# EAGLE design PCB_Minisumo_2018_Educatiu (EAGLE 9.2.1)

## Sheet 1 of 2
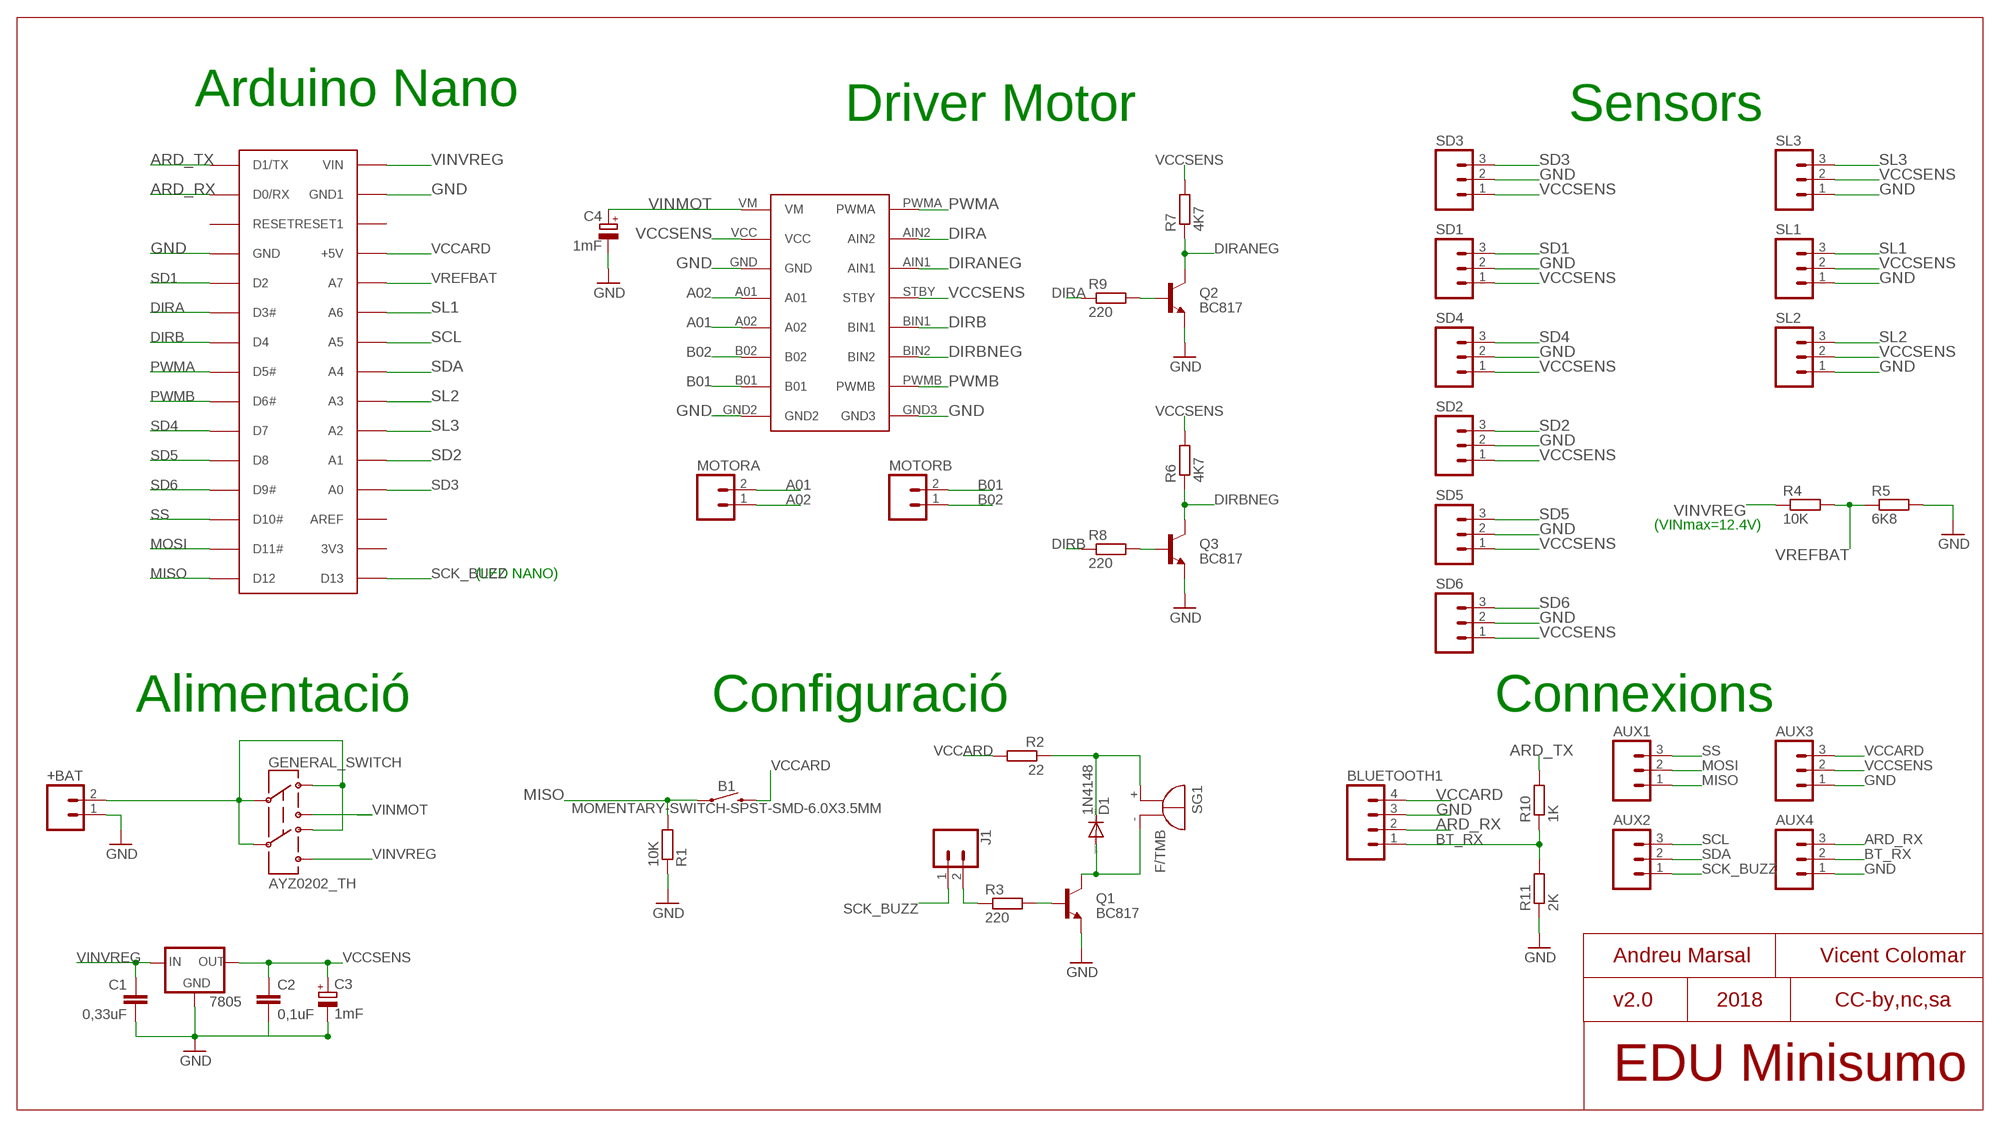
[diagram p0: schematic, sheet 1]

### Parts
7805  V_REG_78XXSINK  [TO220-IGO]
+BAT  M02LOCK_LONGPADS  [1X02_LOCK_LONGPADS]
AUX1  M03PTH  [1X03]
AUX2  M03PTH  [1X03]
AUX3  M03PTH  [1X03]
AUX4  M03PTH  [1X03]
B1  MOMENTARY-SWITCH-SPST-SMD-6.0X3.5MM  [TACTILE_SWITCH_SMD_6.0X3.5MM]
BLUETOOTH1  M04PTH  [1X04]
C1  0,33uF  C-EUC1206K  [C1206K]
C2  0,1uF  C-EUC1206K  [C1206K]
C3  1mF  CPOL-EUE2.5-6  [E2,5-6]
C4  1mF  CPOL-EUE2.5-6  [E2,5-6]
D1  1N4148  DIODE-SOD106-R  [SOD106-R]
GENERAL_SWITCH  AYZ0202_TH  [AYZ0202_TH]
J1  CONN_02  [1X02]
MOTORA  M023.5MM  [SCREWTERMINAL-3.5MM-2]
MOTORB  M023.5MM  [SCREWTERMINAL-3.5MM-2]
Q1  BC817  TRANSISTOR_NPNTO92  [TO-92]
Q2  BC817  TRANSISTOR_NPNTO92  [TO-92]
Q3  BC817  TRANSISTOR_NPNTO92  [TO-92]
R1  10K  R-EU_R1206  [R1206]
R2  22  R-EU_R1206  [R1206]
R3  220  R-EU_M1206  [M1206]
R4  10K  R-EU_R1206  [R1206]
R5  6K8  R-EU_R1206  [R1206]
R6  4K7  R-EU_M1206  [M1206]
R7  4K7  R-EU_M1206  [M1206]
R8  220  R-EU_M1206  [M1206]
R9  220  R-EU_M1206  [M1206]
R10  1K  R-EU_R1206  [R1206]
R11  2K  R-EU_R1206  [R1206]
SD1  M03PTH  [1X03]
SD2  M03PTH  [1X03]
SD3  M03PTH  [1X03]
SD4  M03PTH  [1X03]
SD5  M03PTH  [1X03]
SD6  M03PTH  [1X03]
SG1  F/TMB  [F/TMB]
SL1  M03PTH  [1X03]
SL2  M03PTH  [1X03]
SL3  M03PTH  [1X03]
U$1  ARDUINONANONOHOLES  [PDIP-32NOHOLES]
U$2  TB6612FNG_SPARKFUN  [TB6612FNG_SPARKFUN]

### Nets
A01: MOTORA.2 U$2.A02
A02: MOTORA.1 U$2.A01
ARD_RX: AUX4.3 BLUETOOTH1.2 U$1.D0/RX ; also sheet 2
ARD_TX: R10.2 U$1.D1/TX ; also sheet 2
B01: MOTORB.2 U$2.B01
B02: MOTORB.1 U$2.B02
BT_RX: AUX4.2 BLUETOOTH1.1 R10.1 R11.2
DIRA: R9.1 U$1.D3(D3#) U$2.AIN2
DIRANEG: Q2.3(C) R7.1 U$2.AIN1
DIRB: R8.1 U$1.D4 U$2.BIN1
DIRBNEG: Q3.3(C) R6.1 U$2.BIN2
GND: 7805.GND +BAT.1 AUX3.1 AUX4.1 BLUETOOTH1.3 C1.2 C2.2 C3.- C4.- Q1.1(E) Q2.1(E) Q3.1(E) R1.1 R5.2 R11.1 SD1.2 SD2.2 SD3.2 SD4.2 SD5.2 SD6.2 SL1.1 SL2.1 SL3.1 U$1.GND U$1.GND1 U$2.GND U$2.GND2 U$2.GND3 ; also sheet 2
MISO: AUX1.1 B1.1 R1.2 U$1.D12 ; also sheet 2
MOSI: AUX1.2 U$1.D11(D11#) ; also sheet 2
N$1: J1.2 R3.1
N$3: Q1.2(B) R3.2
N$5: D1.A Q1.3(C) SG1.-
N$6: Q2.2(B) R9.2
N$7: D1.C R2.1 SG1.+
N$9: Q3.2(B) R8.2
PWMA: U$1.D5(D5#) U$2.PWMA
PWMB: U$1.D6(D6#) U$2.PWMB
SCK_BUZZ: AUX2.1 J1.1 U$1.D13 ; also sheet 2
SCL: AUX2.3 U$1.A5 ; also sheet 2
SD1: SD1.3 U$1.D2
SD2: SD2.3 U$1.A1
SD3: SD3.3 U$1.A0
SD4: SD4.3 U$1.D7
SD5: SD5.3 U$1.D8
SD6: SD6.3 U$1.D9(D9#)
SDA: AUX2.2 U$1.A4 ; also sheet 2
SL1: SL1.3 U$1.A6
SL2: SL2.3 U$1.A3
SL3: SL3.3 U$1.A2
SS: AUX1.3 U$1.D10(D10#) ; also sheet 2
VBAT: +BAT.2 GENERAL_SWITCH.C1 GENERAL_SWITCH.C2 GENERAL_SWITCH.D1 GENERAL_SWITCH.D2
VCCARD: AUX3.3 B1.2 BLUETOOTH1.4 R2.2 U$1.+5V ; also sheet 2
VCCSENS: 7805.OUT AUX3.2 C2.1 C3.+ R6.2 R7.2 SD1.1 SD2.1 SD3.1 SD4.1 SD5.1 SD6.1 SL1.2 SL2.2 SL3.2 U$2.STBY U$2.VCC ; also sheet 2
VINMOT: C4.+ GENERAL_SWITCH.B1 U$2.VM
VINVREG: 7805.IN C1.1 GENERAL_SWITCH.B2 R4.1 U$1.VIN ; also sheet 2
VREFBAT: R4.2 R5.1 U$1.A7
Unconnected: U$1.3V3 U$1.AREF U$1.RESET U$1.RESET1

### Notes on the sheet
- Arduino Nano | Driver Motor | Sensors
- (VINmax=12.4V)
- (LED NANO)
- Alimentació | Configuració | Connexions
- Andreu Marsal | Vicent Colomar
- v2.0 | 2018 | CC-by,nc,sa
- EDU Minisumo

## Sheet 2 of 2
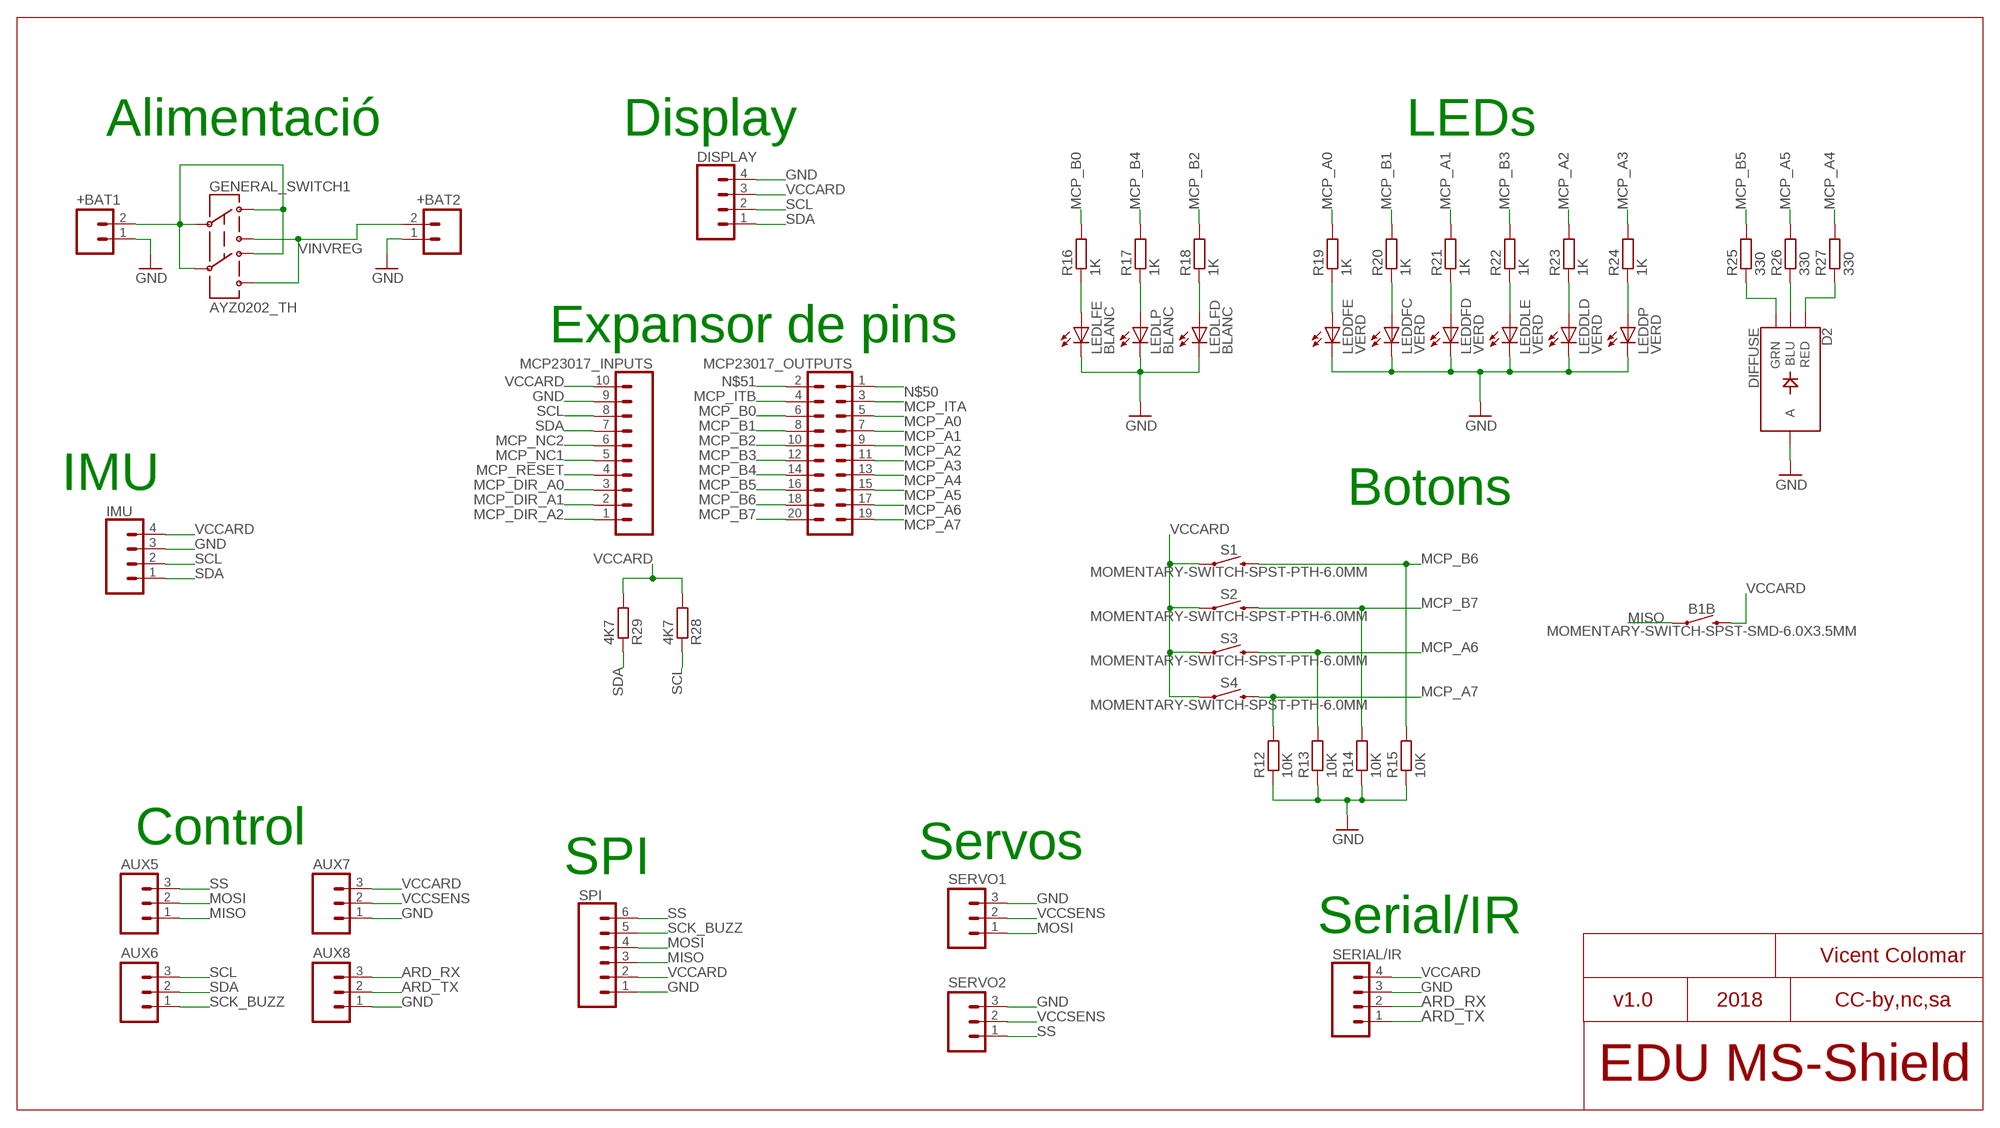
[diagram p1: schematic, sheet 2]

### Parts
+BAT1  M02LOCK_LONGPADS  [1X02_LOCK_LONGPADS]
+BAT2  M02LOCK_LONGPADS  [1X02_LOCK_LONGPADS]
AUX5  M03PTH  [1X03]
AUX6  M03PTH  [1X03]
AUX7  M03PTH  [1X03]
AUX8  M03PTH  [1X03]
B1B  MOMENTARY-SWITCH-SPST-SMD-6.0X3.5MM  [TACTILE_SWITCH_SMD_6.0X3.5MM]
D2  DIFFUSE  LED-RGB-CADIFFUSE  [LED-RGB-THRU]
DISPLAY  CONN_04  [1X04]
GENERAL_SWITCH1  AYZ0202_TH  [AYZ0202_TH]
IMU  CONN_04  [1X04]
LEDDFC  VERD  LEDSMT1206  [1206]
LEDDFD  VERD  LEDSMT1206  [1206]
LEDDFE  VERD  LEDSMT1206  [1206]
LEDDLD  VERD  LEDSMT1206  [1206]
LEDDLE  VERD  LEDSMT1206  [1206]
LEDDP  VERD  LEDSMT1206  [1206]
LEDLFD  BLANC  LEDSMT1206  [1206]
LEDLFE  BLANC  LEDSMT1206  [1206]
LEDLP  BLANC  LEDSMT1206  [1206]
MCP23017_INPUTS  CONN_10"  [1X10]
MCP23017_OUTPUTS  CONN_10X2  [2X10]
R12  10K  R-EU_M1206  [M1206]
R13  10K  R-EU_M1206  [M1206]
R14  10K  R-EU_M1206  [M1206]
R15  10K  R-EU_M1206  [M1206]
R16  1K  R-EU_M1206  [M1206]
R17  1K  R-EU_M1206  [M1206]
R18  1K  R-EU_M1206  [M1206]
R19  1K  R-EU_M1206  [M1206]
R20  1K  R-EU_M1206  [M1206]
R21  1K  R-EU_M1206  [M1206]
R22  1K  R-EU_M1206  [M1206]
R23  1K  R-EU_M1206  [M1206]
R24  1K  R-EU_M1206  [M1206]
R25  330  R-EU_M1206  [M1206]
R26  330  R-EU_M1206  [M1206]
R27  330  R-EU_M1206  [M1206]
R28  4K7  R-EU_M1206  [M1206]
R29  4K7  R-EU_M1206  [M1206]
S1  MOMENTARY-SWITCH-SPST-PTH-6.0MM  [TACTILE_SWITCH_PTH_6.0MM]
S2  MOMENTARY-SWITCH-SPST-PTH-6.0MM  [TACTILE_SWITCH_PTH_6.0MM]
S3  MOMENTARY-SWITCH-SPST-PTH-6.0MM  [TACTILE_SWITCH_PTH_6.0MM]
S4  MOMENTARY-SWITCH-SPST-PTH-6.0MM  [TACTILE_SWITCH_PTH_6.0MM]
SERIAL/IR  CONN_04  [1X04]
SERVO1  M03PTH  [1X03]
SERVO2  M03PTH  [1X03]
SPI  CONN_06SILK_FEMALE_PTH  [1X06]

### Nets
ARD_RX: AUX8.3 SERIAL/IR.2 ; also sheet 1
ARD_TX: AUX8.2 SERIAL/IR.1 ; also sheet 1
GND: +BAT1.1 +BAT2.1 AUX7.1 AUX8.1 D2.2(A) DISPLAY.4 IMU.3 LEDDFC.C LEDDFD.C LEDDFE.C LEDDLD.C LEDDLE.C LEDDP.C LEDLFD.C LEDLFE.C LEDLP.C MCP23017_INPUTS.9 R12.1 R13.1 R14.1 R15.1 SERIAL/IR.3 SERVO1.3 SERVO2.3 SPI.1 ; also sheet 1
MCP_A0: MCP23017_OUTPUTS.5 R19.2
MCP_A1: MCP23017_OUTPUTS.7 R21.2
MCP_A2: MCP23017_OUTPUTS.9 R23.2
MCP_A3: MCP23017_OUTPUTS.11 R24.2
MCP_A4: MCP23017_OUTPUTS.13 R27.2
MCP_A5: MCP23017_OUTPUTS.15 R26.2
MCP_A6: MCP23017_OUTPUTS.17 R13.2 S3.3
MCP_A7: MCP23017_OUTPUTS.19 R12.2 S4.3
MCP_B0: MCP23017_OUTPUTS.6 R16.2
MCP_B1: MCP23017_OUTPUTS.8 R20.2
MCP_B2: MCP23017_OUTPUTS.10 R18.2
MCP_B3: MCP23017_OUTPUTS.12 R22.2
MCP_B4: MCP23017_OUTPUTS.14 R17.2
MCP_B5: MCP23017_OUTPUTS.16 R25.2
MCP_B6: MCP23017_OUTPUTS.18 R15.2 S1.3
MCP_B7: MCP23017_OUTPUTS.20 R14.2 S2.3
MCP_DIR_A0: MCP23017_INPUTS.3
MCP_DIR_A1: MCP23017_INPUTS.2
MCP_DIR_A2: MCP23017_INPUTS.1
MCP_ITA: MCP23017_OUTPUTS.3
MCP_ITB: MCP23017_OUTPUTS.4
MCP_NC1: MCP23017_INPUTS.5
MCP_NC2: MCP23017_INPUTS.6
MCP_RESET: MCP23017_INPUTS.4
MISO: AUX5.1 B1B.1 SPI.3 ; also sheet 1
MOSI: AUX5.2 SERVO1.1 SPI.4 ; also sheet 1
N$10: D2.3(GRN) R25.1
N$11: LEDLFE.A R16.1
N$12: LEDLP.A R17.1
N$13: LEDLFD.A R18.1
N$18: LEDDFE.A R19.1
N$19: LEDDFC.A R20.1
N$20: LEDDFD.A R21.1
N$21: LEDDLE.A R22.1
N$22: LEDDLD.A R23.1
N$23: LEDDP.A R24.1
N$30: D2.4(BLU) R26.1
N$31: D2.1(RED) R27.1
N$50: MCP23017_OUTPUTS.1
N$51: MCP23017_OUTPUTS.2
SCK_BUZZ: AUX6.1 SPI.5 ; also sheet 1
SCL: AUX6.3 DISPLAY.2 IMU.2 MCP23017_INPUTS.8 R28.1 ; also sheet 1
SDA: AUX6.2 DISPLAY.1 IMU.1 MCP23017_INPUTS.7 R29.1 ; also sheet 1
SS: AUX5.3 SERVO2.1 SPI.6 ; also sheet 1
VBAT1: +BAT1.2 GENERAL_SWITCH1.C1 GENERAL_SWITCH1.C2 GENERAL_SWITCH1.D1 GENERAL_SWITCH1.D2
VCCARD: AUX7.3 B1B.2 DISPLAY.3 IMU.4 MCP23017_INPUTS.10 R28.2 R29.2 S1.1 S2.1 S3.1 S4.1 SERIAL/IR.4 SPI.2 ; also sheet 1
VCCSENS: AUX7.2 SERVO1.2 SERVO2.2 ; also sheet 1
VINVREG: +BAT2.2 GENERAL_SWITCH1.B1 GENERAL_SWITCH1.B2 ; also sheet 1

### Notes on the sheet
- Alimentació | Display | LEDs
- Expansor de pins
- IMU | Botons
- Control | Servos
- SPI
- Serial/IR
- Vicent Colomar
- v1.0 | 2018 | CC-by,nc,sa
- EDU MS-Shield

## Library data of the parts
7805 = SparkFun:V_REG_78XX: Voltage Regulator Standard 7805 5V regulator. IGO (Input Ground Output). Spark Fun Electronics SKU : COM-00107
+BAT +BAT1 +BAT2 MOTORA MOTORB = SparkFun:M02: Header 2 Standard 2-pin 0.1" header. Use with straight break away headers (SKU : PRT-00116), right angle break away headers (PRT-00553), swiss pins (PRT-00743), machine pins (PRT-00117), and female headers (PRT-00115). Molex polarized connector foot print use with SKU : PRT-08233 with associated crimp pins and housings.
AUX1-AUX8 SD1-SD6 SERVO1 SERVO2 SL1-SL3 = SparkFun:M03: Header 3 Standard 3-pin 0.1" header. Use with straight break away headers (SKU : PRT-00116), right angle break away headers (PRT-00553), swiss pins (PRT-00743), machine pins (PRT-00117), and female headers (PRT-00115). Molex polarized connector foot print use with SKU : PRT-08232 with associated crimp pins and housings.
B1 B1B = SparkFun-Switches:MOMENTARY-SWITCH-SPST: Momentary Switch (Pushbutton) - SPST Normally-open (NO) SPST momentary switches (buttons, pushbuttons). Variants PTH-12MM - 12mm square, through-hole Momentary Pushbutton Switch - 12mm Square <https://www.sparkfun.com/products/9190> (COM-09190) PTH-6.0MM, PTH-6.0MM-KIT - 6.0mm square, through-hole Mini Pushbutton Switch <https://www.sparkfun.com/products/97> (COM-00097) KIT package intended for soldering kit's - only one side of pads' copper is exposed. PTH-RIGHT-ANGLE-KIT - Right-angle, through-hole Right Angle Tactile Button <https://www.sparkfun.com/products/10791> - Used on SparkFun BigTime Watch Kit <https://www.sparkfun.com/products/11734> SMD-12MM - 12mm square, surface-mount Tactile Button - SMD (12mm) <https://www.sparkfun.com/products/12993> (COM-12993) Used on SparkFun PicoBoard <https://www.sparkfun.com/products/11888> SMD-4.5MM - 4.5mm Square Trackball Switch Used on SparkFun Blackberry Trackballer Breakout <https://www.sparkfun.com/products/13169> SMD-4.6MMX2.8MM - 4.60mm x 2.80mm, surface mount Used on SparkFun SAMD21 Mini Breakout <https://www.sparkfun.com/products/13664> SMD-5.2MM, SMD-5.2-REDUNDANT - 5.2mm square, surface-mount Mini Pushbutton Switch - SMD <https://www.sparkfun.com/products/8720> (COM-08720) Used on Arduino Pro Mini <https://www.sparkfun.com/products/11114> REDUNDANT package connects both switch circuits together SMD-6.0X3.5MM - 6.0 x 3.5mm, surface mount Momentary Reset Switch SMD <https://www.sparkfun.com/products/8229> (COM-08229) SMD-6.2MM-TALL - 6.2mm square, surface mount Tactile Button - SMD (6mm) <https://www.sparkfun.com/products/12992> Used on SparkFun Digital Sandbox <https://www.sparkfun.com/products/12651> SMD-RIGHT-ANGLE - Right-angle, surface mount Used on SparkFun Block for Intel® Edison - Arduino <https://www.sparkfun.com/products/13036>; PROD_ID: SWCH-00815; SF_SKU: COM-08229
BLUETOOTH1 = SparkFun:M04: Header 4 Standard 4-pin 0.1" header. Use with straight break away headers (SKU : PRT-00116), right angle break away headers (PRT-00553), swiss pins (PRT-00743), machine pins (PRT-00117), and female headers (PRT-00115). Molex polarized connector foot print use with SKU : PRT-08231 with associated crimp pins and housings. 1MM SMD Version SKU: PRT-10208
C1 C2 = rcl:C-EU: CAPACITOR, European symbol; SPICEPREFIX: C
C3 C4 = rcl:CPOL-EU: POLARIZED CAPACITOR, European symbol; SPICEPREFIX: C
D1 = diode:DIODE-: DIODE
D2 = SparkFun-LED:LED-RGB-CA: LED-RGB Diffused Common Anode Packages: LED RGB-THRU P-LCC-4-3 LED-TRICOLOR-SMD SparkFun Products: RGB Diffused Common Anode- Diffuse <[https://www.sparkfun.com/products/10821]> RGB Diffused Common Anode - Clear <[https://www.sparkfun.com/products/10820]> Qduino Mini <[https://www.sparkfun.com/products/13614]> Triple Output LED RGB - SMD <https://www.sparkfun.com/products/7844>; PROD_ID: DIO-10632
DISPLAY IMU SERIAL/IR = SparkFun-Connectors:CONN_04: Multi connection point. Often used as Generic Header-pin footprint for 0.1 inch spaced/style header connections On any of the 0.1 inch spaced packages, you can populate with these: Break Away Headers - Straight <https://www.sparkfun.com/products/116> (PRT-00116) Break Away Male Headers - Right Angle <https://www.sparkfun.com/products/553> (PRT-00553) Female Headers <https://www.sparkfun.com/products/115> (PRT-00115) Break Away Headers - Machine Pin <https://www.sparkfun.com/products/117> (PRT-00117) Break Away Female Headers - Swiss Machine Pin <https://www.sparkfun.com/products/743> (PRT-00743) For SCREWTERMINALS and SPRING TERMINALS visit here: Screw Terimnals on SparkFun.com <https://www.sparkfun.com/search/results?term=Screw+Terminals> (5mm/3.5mm/2.54mm spacing) This device is also useful as a general connection point to wire up your design to another part of your project. Our various solder wires solder well into these plated through hole pads. Hook-Up Wire - Assortment (Stranded, 22 AWG) <https://www.sparkfun.com/products/11375> (PRT-11375) Hook-Up Wire - Assortment (Solid Core, 22 AWG) <https://www.sparkfun.com/products/11367> (PRT-11367) View the entire wire category on our website here <https://www.sparkfun.com/categories/141> Special notes: Molex polarized connector foot print use with SKU : PRT-08231 with associated crimp pins and housings. 1MM SMD Version SKU: PRT-10208; PROD_ID: CONN-09696
GENERAL_SWITCH GENERAL_SWITCH1 = 1r_BAT_guissona:AYZ0202_TH
J1 = SparkFun-Connectors:CONN_02: Multi connection point. Often used as Generic Header-pin footprint for 0.1 inch spaced/style header connections On any of the 0.1 inch spaced packages, you can populate with these: Break Away Headers - Straight <https://www.sparkfun.com/products/116> (PRT-00116) Break Away Male Headers - Right Angle <https://www.sparkfun.com/products/553> (PRT-00553) Female Headers <https://www.sparkfun.com/products/115> (PRT-00115) Break Away Headers - Machine Pin <https://www.sparkfun.com/products/117> (PRT-00117) Break Away Female Headers - Swiss Machine Pin <https://www.sparkfun.com/products/743> (PRT-00743) For SCREWTERMINALS and SPRING TERMINALS visit here: Screw Terimnals on SparkFun.com <https://www.sparkfun.com/search/results?term=Screw+Terminals> (5mm/3.5mm/2.54mm spacing) This device is also useful as a general connection point to wire up your design to another part of your project. Our various solder wires solder well into these plated through hole pads. Hook-Up Wire - Assortment (Stranded, 22 AWG) <https://www.sparkfun.com/products/11375> (PRT-11375) Hook-Up Wire - Assortment (Solid Core, 22 AWG) <https://www.sparkfun.com/products/11367> (PRT-11367) View the entire wire category on our website here <https://www.sparkfun.com/categories/141> Special notes: Molex polarized connector foot print use with: PRT-08233 with associated crimp pins and housings. 2.54_SCREWTERM for use with PRT-10571. 3.5mm Screw Terminal footprints for PRT-08084 5mm Screw Terminal footprints for use with PRT-08432
LEDDFC LEDDFD LEDDFE LEDDLD LEDDLE LEDDP LEDLFD LEDLFE LEDLP = led:LED: LED OSRAM: - CHIPLED LG R971, LG N971, LY N971, LG Q971, LY Q971, LO R971, LY R971 LH N974, LH R974 LS Q976, LO Q976, LY Q976 LO Q996 - Hyper CHIPLED LW Q18S LB Q993, LB Q99A, LB R99A - SideLED LS A670, LO A670, LY A670, LG A670, LP A670 LB A673, LV A673, LT A673, LW A673 LH A674 LY A675 LS A676, LA A676, LO A676, LY A676, LW A676 LS A679, LY A679, LG A679 - Hyper Micro SIDELED® LS Y876, LA Y876, LO Y876, LY Y876 LT Y87S - SmartLED LW L88C, LW L88S LB L89C, LB L89S, LG L890 LS L89K, LO L89K, LY L89K LS L896, LA L896, LO L896, LY L896 - TOPLED LS T670, LO T670, LY T670, LG T670, LP T670 LSG T670, LSP T670, LSY T670, LOP T670, LYG T670 LG T671, LOG T671, LSG T671 LB T673, LV T673, LT T673, LW T673 LH T674 LS T676, LA T676, LO T676, LY T676, LB T676, LH T676, LSB T676, LW T676 LB T67C, LV T67C, LT T67C, LS T67K, LO T67K, LY T67K, LW E67C LS E67B, LA E67B, LO E67B, LY E67B, LB E67C, LV E67C, LT E67C LW T67C LS T679, LY T679, LG T679 LS T770, LO T770, LY T770, LG T770, LP T770 LB T773, LV T773, LT T773, LW T773 LH T774 LS E675, LA E675, LY E675, LS T675 LS T776, LA T776, LO T776, LY T776, LB T776 LHGB T686 LT T68C, LB T68C - Hyper Mini TOPLED® LB M676 - Mini TOPLED Santana® LG M470 LS M47K, LO M47K, LY M47K Source: http://www.osram.convergy.de LUXEON: - LUMILED® LXK2-PW12-R00, LXK2-PW12-S00, LXK2-PW14-U00, LXK2-PW14-V00 LXK2-PM12-R00, LXK2-PM12-S00, LXK2-PM14-U00 LXK2-PE12-Q00, LXK2-PE12-R00, LXK2-PE12-S00, LXK2-PE14-T00, LXK2-PE14-U00 LXK2-PB12-K00, LXK2-PB12-L00, LXK2-PB12-M00, LXK2-PB14-N00, LXK2-PB14-P00, LXK2-PB14-Q00 LXK2-PR12-L00, LXK2-PR12-M00, LXK2-PR14-Q00, LXK2-PR14-R00 LXK2-PD12-Q00, LXK2-PD12-R00, LXK2-PD12-S00 LXK2-PH12-R00, LXK2-PH12-S00 LXK2-PL12-P00, LXK2-PL12-Q00, LXK2-PL12-R00 Source: www.luxeon.com KINGBRIGHT: KA-3528ASYC Source: www.kingbright.com
MCP23017_INPUTS = SparkFun-Connectors:CONN_10: Multi connection point. Often used as Generic Header-pin footprint for 0.1 inch spaced/style header connections On any of the 0.1 inch spaced packages, you can populate with these: Break Away Headers - Straight <https://www.sparkfun.com/products/116> (PRT-00116) Break Away Male Headers - Right Angle <https://www.sparkfun.com/products/553> (PRT-00553) Female Headers <https://www.sparkfun.com/products/115> (PRT-00115) Break Away Headers - Machine Pin <https://www.sparkfun.com/products/117> (PRT-00117) Break Away Female Headers - Swiss Machine Pin <https://www.sparkfun.com/products/743> (PRT-00743) Arduino Stackable Header - 10 Pin <https://www.sparkfun.com/products/11376> (PRT-11376) For SCREWTERMINALS and SPRING TERMINALS visit here: Screw Terimnals on SparkFun.com <https://www.sparkfun.com/search/results?term=Screw+Terminals> (5mm/3.5mm/2.54mm spacing) This device is also useful as a general connection point to wire up your design to another part of your project. Our various solder wires solder well into these plated through hole pads. Hook-Up Wire - Assortment (Stranded, 22 AWG) <https://www.sparkfun.com/products/11375> (PRT-11375) Hook-Up Wire - Assortment (Solid Core, 22 AWG) <https://www.sparkfun.com/products/11367> (PRT-11367) View the entire wire category on our website here <https://www.sparkfun.com/categories/141> Special notes: Molex polarized connector foot print use with SKU : PRT-08231 with associated crimp pins and housings. 1MM SMD Version SKU: PRT-10208 NOTES ON THE VARIANTS LOCK and LOCK_LONGPADS... This footprint was designed to help hold the alignment of a through-hole component (i.e. 6-pin header) while soldering it into place. You may notice that each hole has been shifted either up or down by 0.005 of an inch from it's more standard position (which is a perfectly straight line). This slight alteration caused the pins (the squares in the middle) to touch the edges of the holes. Because they are alternating, it causes a "brace" to hold the component in place. 0.005 has proven to be the perfect amount of "off-center" position when using our standard breakaway headers. Although looks a little odd when you look at the bare footprint, once you have a header in there, the alteration is very hard to notice. Also,if you push a header all the way into place, it is covered up entirely on the bottom side.; PROD_ID: CONN-11563
MCP23017_OUTPUTS = SparkFun-Connectors:CONN_10X2: Multi connection point. Often used as Generic Header-pin footprint for 0.1 inch spaced/style header connections On any of the 0.1 inch spaced packages, you can populate with these: Break Away Headers - Straight <https://www.sparkfun.com/products/116> (PRT-00116) Break Away Male Headers - Right Angle <https://www.sparkfun.com/products/553> (PRT-00553) Female Headers <https://www.sparkfun.com/products/115> (PRT-00115) Break Away Headers - Machine Pin <https://www.sparkfun.com/products/117> (PRT-00117) Break Away Female Headers - Swiss Machine Pin <https://www.sparkfun.com/products/743> (PRT-00743) Special note about the "SPECIAL" package: This was SPECIALLY designed to be used with our Graphic LCD Backpack. Be sure you want to use this! It is not only staggered on each line of header holes, but IT IS ALSO offset of the center point of the top and bottom lines by 5 mil. This causes the headers to lock into place on the "standard" footprint on the LCD screen. The extra squares on the tdocu layer are there simply to reference other pins (if you were to actually populate a longer header than ten long - this is what we do with the backpacks).
Q1-Q3 = SparkFun:TRANSISTOR_NPN: Transistor NPN BJT configuration in SOT23 package. MMBT2222 is the common NPN we use. Double check BCE configuration again layout.
R1 R2 R4 R5 R10 R11 = resistor:R-EU_: RESISTOR, European symbol
R3 R6-R9 R12-R29 = rcl:R-EU_: RESISTOR, European symbol; SPICEPREFIX: R
S1-S4 = SparkFun-Switches:MOMENTARY-SWITCH-SPST: Momentary Switch (Pushbutton) - SPST Normally-open (NO) SPST momentary switches (buttons, pushbuttons). Variants PTH-12MM - 12mm square, through-hole Momentary Pushbutton Switch - 12mm Square <https://www.sparkfun.com/products/9190> (COM-09190) PTH-6.0MM, PTH-6.0MM-KIT - 6.0mm square, through-hole Mini Pushbutton Switch <https://www.sparkfun.com/products/97> (COM-00097) KIT package intended for soldering kit's - only one side of pads' copper is exposed. PTH-RIGHT-ANGLE-KIT - Right-angle, through-hole Right Angle Tactile Button <https://www.sparkfun.com/products/10791> - Used on SparkFun BigTime Watch Kit <https://www.sparkfun.com/products/11734> SMD-12MM - 12mm square, surface-mount Tactile Button - SMD (12mm) <https://www.sparkfun.com/products/12993> (COM-12993) Used on SparkFun PicoBoard <https://www.sparkfun.com/products/11888> SMD-4.5MM - 4.5mm Square Trackball Switch Used on SparkFun Blackberry Trackballer Breakout <https://www.sparkfun.com/products/13169> SMD-4.6MMX2.8MM - 4.60mm x 2.80mm, surface mount Used on SparkFun SAMD21 Mini Breakout <https://www.sparkfun.com/products/13664> SMD-5.2MM, SMD-5.2-REDUNDANT - 5.2mm square, surface-mount Mini Pushbutton Switch - SMD <https://www.sparkfun.com/products/8720> (COM-08720) Used on Arduino Pro Mini <https://www.sparkfun.com/products/11114> REDUNDANT package connects both switch circuits together SMD-6.0X3.5MM - 6.0 x 3.5mm, surface mount Momentary Reset Switch SMD <https://www.sparkfun.com/products/8229> (COM-08229) SMD-6.2MM-TALL - 6.2mm square, surface mount Tactile Button - SMD (6mm) <https://www.sparkfun.com/products/12992> Used on SparkFun Digital Sandbox <https://www.sparkfun.com/products/12651> SMD-RIGHT-ANGLE - Right-angle, surface mount Used on SparkFun Block for Intel® Edison - Arduino <https://www.sparkfun.com/products/13036>; PROD_ID: SWCH-08441; SF_SKU: COM-00097
SG1 = buzzer:F/TMB: BUZZER Source: Buerklin; OC_FARNELL: unknown; OC_NEWARK: unknown
SPI = SparkFun-Connectors:CONN_06: Multi connection point. Often used as Generic Header-pin footprint for 0.1 inch spaced/style header connections On any of the 0.1 inch spaced packages, you can populate with these: Break Away Headers - Straight <https://www.sparkfun.com/products/116> (PRT-00116) Break Away Male Headers - Right Angle <https://www.sparkfun.com/products/553> (PRT-00553) Female Headers <https://www.sparkfun.com/products/115> (PRT-00115) Break Away Headers - Machine Pin <https://www.sparkfun.com/products/117> (PRT-00117) Break Away Female Headers - Swiss Machine Pin <https://www.sparkfun.com/products/743> (PRT-00743) Arduino Stackable Header - 6 Pin <https://www.sparkfun.com/products/9280> (PRT-09280) For SCREWTERMINALS and SPRING TERMINALS visit here: Screw Terimnals on SparkFun.com <https://www.sparkfun.com/search/results?term=Screw+Terminals> (5mm/3.5mm/2.54mm spacing) This device is also useful as a general connection point to wire up your design to another part of your project. Our various solder wires solder well into these plated through hole pads. Hook-Up Wire - Assortment (Stranded, 22 AWG) <https://www.sparkfun.com/products/11375> (PRT-11375) Hook-Up Wire - Assortment (Solid Core, 22 AWG) <https://www.sparkfun.com/products/11367> (PRT-11367) View the entire wire category on our website here <https://www.sparkfun.com/categories/141>; PROD_ID: CONN-08437
U$1 = jet-lib:ARDUINONANO
U$2 = 1r_BAT_guissona:TB6612FNG_SPARKFUN

## Board
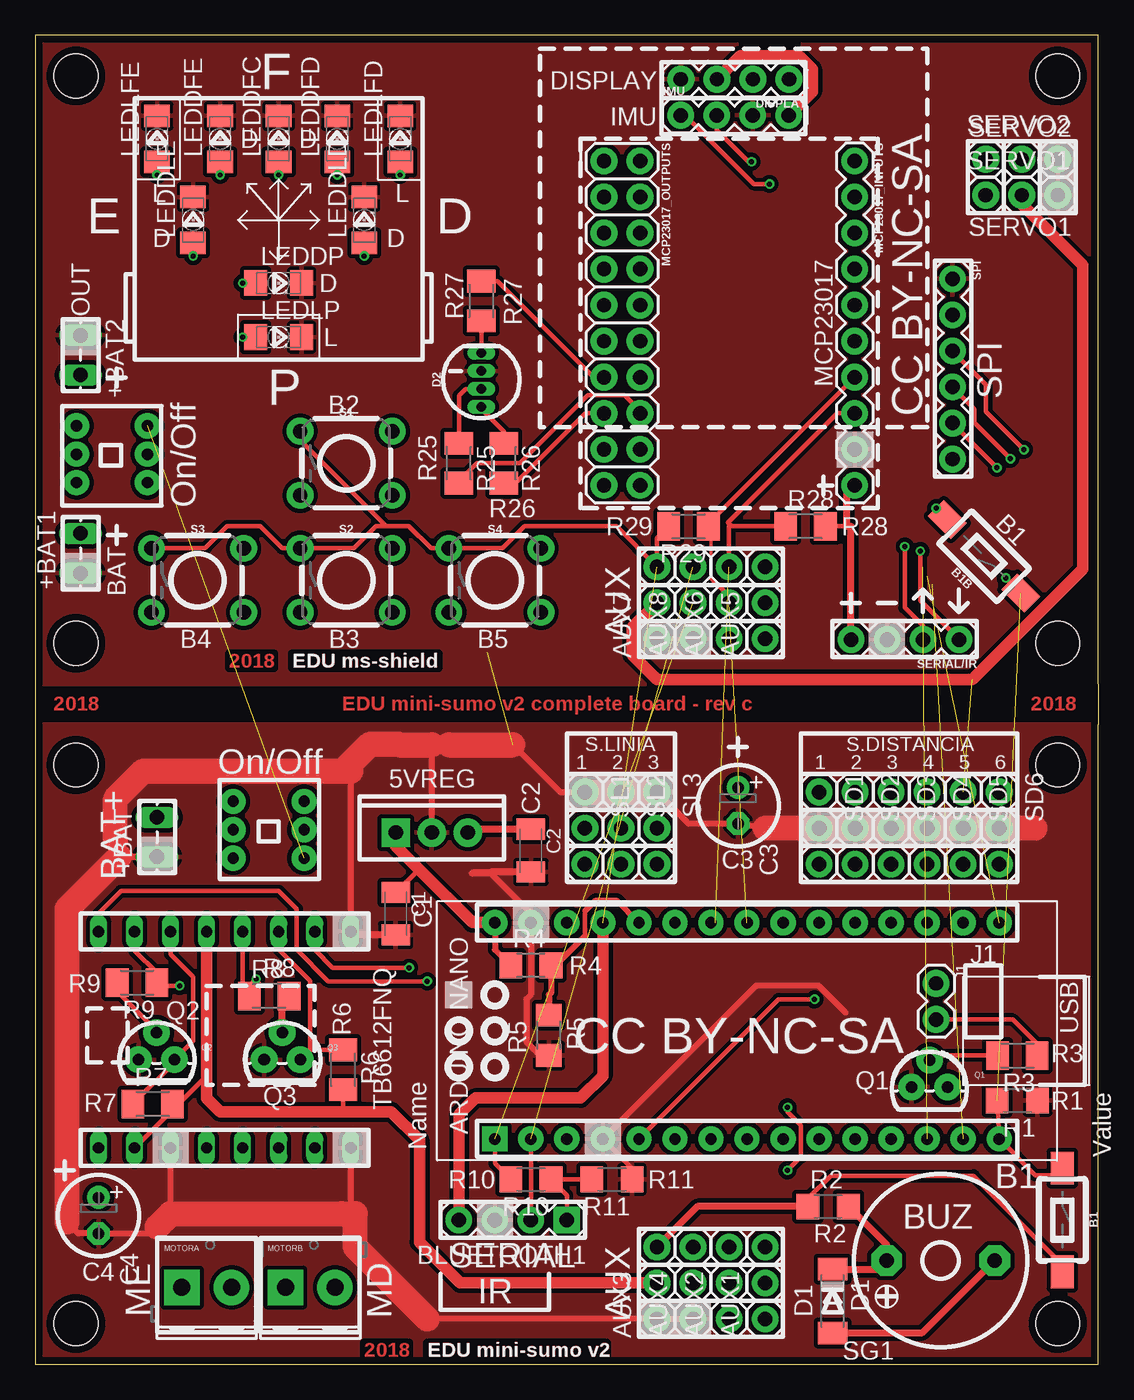
[diagram p2: board, top side]
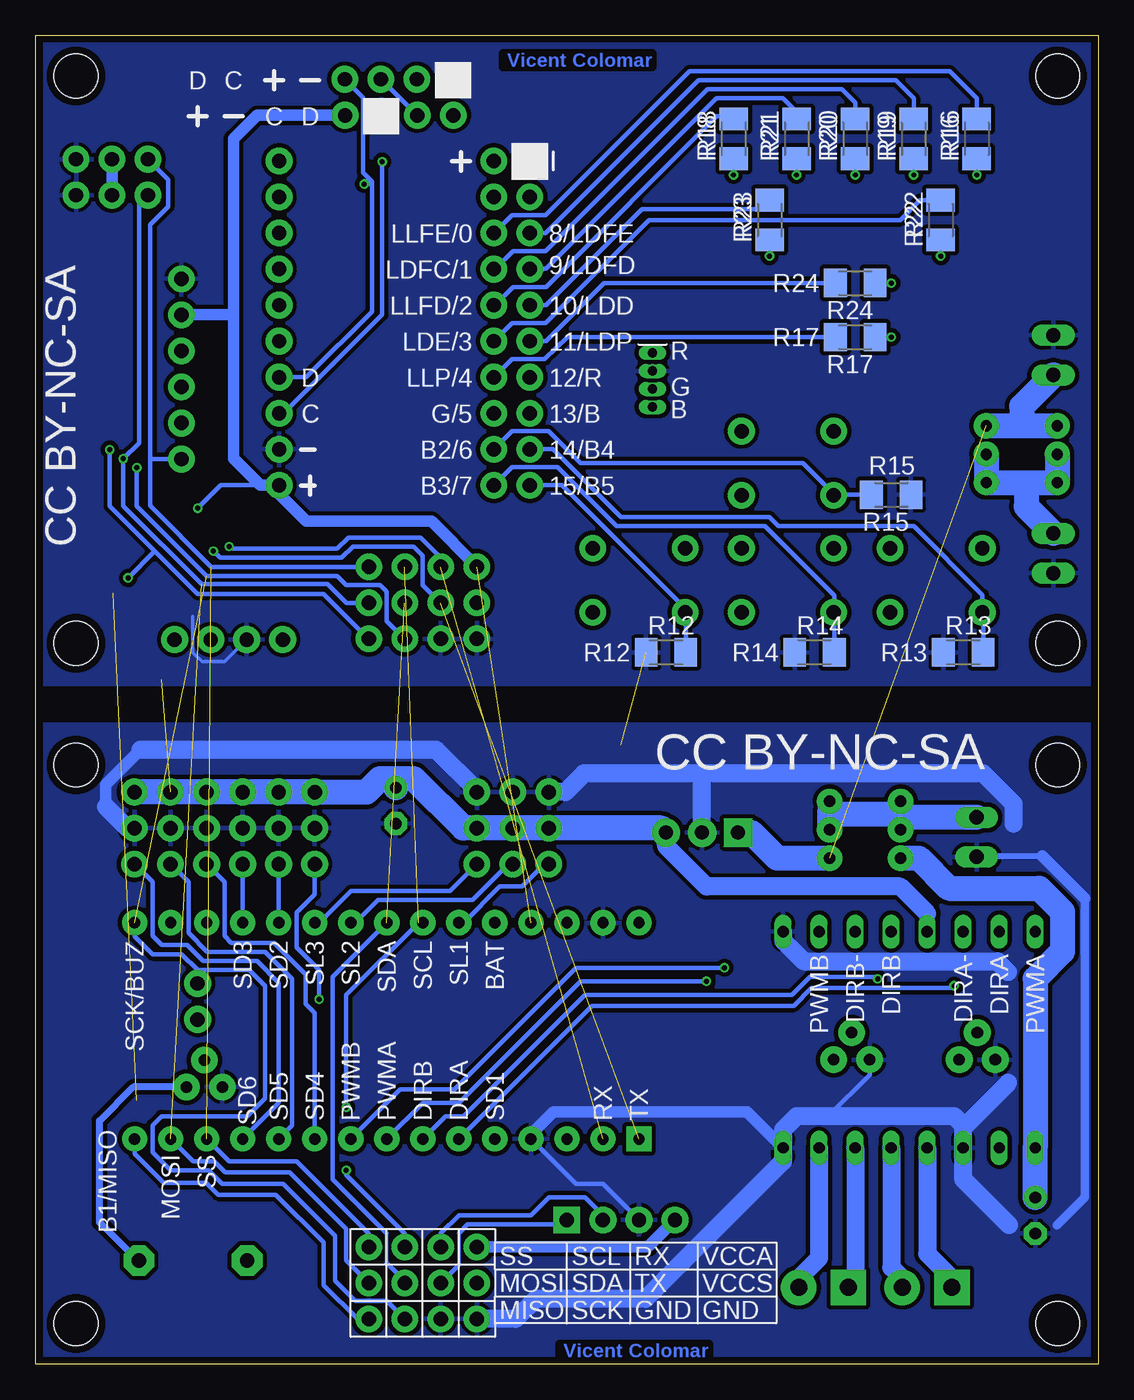
[diagram p3: board, bottom side, seen from below]

Size 74.93 x 93.65 mm. Coordinates in mm from the lower left corner, seen from the top.
Outline: 74.92,45.08 74.92,0 0,0 0,45.08
Outline: 74.92,47.94 74.92,93.65 0,93.65 0,45.09
Outline: 74.93,47.94 74.93,45.09
Copper layers (1*16): Top 0.035mm / dielectric 1.6mm / Bottom 0.035mm
Design rules "Elecrow_2-layer_PCB_eagle_rule": minimum track width 6mil, minimum drill 12mil, track to track 6mil, track to pad 6mil, pad to pad 6mil, via to via 8mil, smd to smd 0mil, copper to edge 20mil, drill to drill 10mil, minimum pad ring 6mil, minimum via ring 6mil, stop-mask expansion 0mil, vias tented up to drill 100mil, thermal gap 10mil
Holes 3.1 mm at 72.07,42.23 72.07,2.86 2.86,42.23 2.86,2.86 72.07,90.81 72.07,50.8 2.86,90.81 2.86,50.8

### Footprints (pad centres in the part's own frame; a part is rotated, then mirrored left to right if it is on the bottom)
TO220-IGO = drill 1 pad 2: GND 0,0; OUT 2.54,0 | drill 1 pad 2 square: IN -2.54,0
1X02_LOCK_LONGPADS = drill 1.016 long: 1 -0.127,0; 2 2.667,0
1X03 = drill 1.016 pad 1.88: 1 0,0; 2 2.54,0; 3 5.08,0
TACTILE_SWITCH_SMD_6.0X3.5MM = smd 2.3 x 1.6: 1 -3.658,0; 2 3.658,0
1X04 = drill 1.016 pad 1.88 square: 1 0,0 | drill 1.016 pad 1.88: 2 2.54,0; 3 5.08,0; 4 7.62,0
C1206K = smd 1.5 x 2: 1 -1.5,0; 2 1.5,0
E2,5-6 = drill 0.813 pad 1.6: + -1.27,0 | drill 0.813 pad 1.6 octagon: - 1.27,0
SOD106-R = smd 1.6 x 2.1: A 2.25,0; C -2.25,0
LED-RGB-THRU = drill 0.65 pad 0.7 long: 1 1.905,0; 2 0.635,0; 3 -0.635,0; 4 -1.905,0
1X04' = drill 1.016 pad 1.88: 1 0,0; 2 2.54,0; 3 5.08,0; 4 7.62,0
AYZ0202_TH = drill 0.8 pad 1.778: B1 -2.5,-2; B2 2.5,-2; C1 -2.5,0; C2 2.5,0; D1 -2.5,2; D2 2.5,2
1X02 = drill 1.016 pad 1.88: 1 0,0; 2 2.54,0
1206 = smd 1.6 x 1.803: A -1.622,0; C 1.622,0
1X10 = drill 1.016 pad 1.88: 1 0,0; 2 2.54,0; 3 5.08,0; 4 7.62,0; 5 10.16,0; 6 12.7,0; 7 15.24,0; 8 17.78,0; 9 20.32,0; 10 22.86,0
2X10 = drill 1.016 pad 1.88: 1 0,0; 2 0,2.54; 3 2.54,0; 4 2.54,2.54; 5 5.08,0; 6 5.08,2.54; 7 7.62,0; 8 7.62,2.54; 9 10.16,0; 10 10.16,2.54; 11 12.7,0; 12 12.7,2.54; 13 15.24,0; 14 15.24,2.54; 15 17.78,0; 16 17.78,2.54; 17 20.32,0; 18 20.32,2.54; 19 22.86,0; 20 22.86,2.54
SCREWTERMINAL-3.5MM-2 = drill 1.2 pad 2.5 square: 1 0,0 | drill 1.2 pad 2.5: 2 3.5,0
TO-92 = drill 0.813 pad 1.88: 1 -1.27,0; 2 0,1.905; 3 1.27,0
R1206 = smd 1.6 x 1.803: 1 -1.422,0; 2 1.422,0
M1206 = smd 1.6 x 2: 1 -1.4,0; 2 1.4,0
TACTILE_SWITCH_PTH_6.0MM = drill 1.016 pad 1.88: 1 -3.251,2.261; 2 3.251,2.261; 3 -3.251,-2.261; 4 3.251,-2.261
F/TMB = drill 1.016 pad 2.159 octagon: + 3.81,0; - -3.81,0
1X06 = drill 1.016 pad 1.88: 1 0,0; 2 2.54,0; 3 5.08,0; 4 7.62,0; 5 10.16,0; 6 12.7,0
PDIP-32NOHOLES = drill 0.8 pad 1.778: 3V3 7.62,-15.24; +5V 7.62,10.16; A0 7.62,-10.16; A1 7.62,-7.62; A2 7.62,-5.08; A3 7.62,-2.54; A4 7.62,0; A5 7.62,2.54; A6 7.62,5.08; A7 7.62,7.62; AREF 7.62,-12.7; D0/RX -7.62,15.24; D2 -7.62,7.62; D3 -7.62,5.08; D4 -7.62,2.54; D5 -7.62,0; D6 -7.62,-2.54; D7 -7.62,-5.08; D8 -7.62,-7.62; D9 -7.62,-10.16; D10 -7.62,-12.7; D11 -7.62,-15.24; D12 -7.62,-17.78; D13 7.62,-17.78; GND -7.62,10.16; GND1 7.62,15.24; RESET -7.62,12.7; RESET1 7.62,12.7; VIN 7.62,17.78 | drill 0.8 pad 1.778 square: D1/TX -7.62,17.78
TB6612FNG_SPARKFUN = drill 0.8 long: A01 -7.62,1.27; A02 -7.62,-1.27; AIN1 7.62,3.81; AIN2 7.62,6.35; B01 -7.62,-6.35; B02 -7.62,-3.81; BIN1 7.62,-1.27; BIN2 7.62,-3.81; GND -7.62,3.81; GND2 -7.62,-8.89; GND3 7.62,-8.89; PWMA 7.62,8.89; PWMB 7.62,-6.35; STBY 7.62,1.27; VCC -7.62,6.35; VM -7.62,8.89

### Placement (x,y rotation side)
7805  27.94,37.47 0 top
+BAT  8.57,35.88 90 top
+BAT1  3.17,55.88 90 top
+BAT2  3.17,72.39 270 top
AUX1  51.44,3.17 90 top
AUX2  48.9,3.17 90 top
AUX3  43.81,3.17 90 top
AUX4  46.35,3.17 90 top
AUX5  51.44,51.12 90 top
AUX6  48.9,51.12 90 top
AUX7  43.81,51.12 90 top
AUX8  46.35,51.12 90 top
B1  72.39,10.16 270 top
B1B  66.88,56.94 135 top
BLUETOOTH1  37.47,10.16 180 top
C1  25.4,31.75 270 top
C2  34.92,36.2 270 top
C3  49.53,39.37 270 top
C4  4.45,10.48 270 top
D1  56.2,4.45 270 top
D2  31.43,69.37 90 top
DISPLAY  [1X04']  53.12,90.57 180 top
GENERAL_SWITCH  16.43,37.66 0 top
GENERAL_SWITCH1  5.4,64.14 180 top
IMU  [1X04']  45.48,88.03 0 top
J1  63.5,26.83 270 top
LEDDFC  17.14,86.36 90 top
LEDDFD  21.27,86.36 90 top
LEDDFE  13.02,86.36 90 top
LEDDLD  23.18,80.64 90 top
LEDDLE  11.11,80.64 90 top
LEDDP  17.14,76.2 0 top
LEDLFD  25.72,86.36 90 top
LEDLFE  8.57,86.36 90 top
LEDLP  17.14,72.39 0 top
MCP23017_INPUTS  57.75,84.81 270 top
MCP23017_OUTPUTS  40.08,84.81 270 top
MOTORA  10.32,5.4 0 top
MOTORB  17.62,5.4 0 top
Q1  63.02,19.53 0 top
Q2  8.53,21.45 0 top
Q3  17.39,21.45 0 top
R1  69.22,18.57 180 top
R2  55.88,11.11 180 top
R3  69.22,21.75 180 top
R4  34.92,28.1 0 top
R5  36.2,23.18 270 top
R6  21.69,20.74 270 top
R7  8.26,18.33 0 top
R8  16.49,25.95 0 top
R9  7.17,26.89 180 top
R10  34.92,13.02 180 top
R11  40.64,13.02 180 top
R12  30.48,50.16 0 bottom
R13  9.53,50.16 0 bottom
R14  20,50.16 0 bottom
R15  14.61,61.28 180 bottom
R16  8.57,86.36 90 bottom
R17  17.14,72.39 180 bottom
R18  25.72,86.36 90 bottom
R19  13.02,86.36 90 bottom
R20  17.14,86.36 90 bottom
R21  21.27,86.36 90 bottom
R22  11.11,80.64 90 bottom
R23  23.18,80.64 90 bottom
R24  17.14,76.2 180 bottom
R25  29.84,63.5 270 top
R26  33.02,63.5 270 top
R27  31.43,74.93 90 top
R28  54.29,59.05 0 top
R29  46.04,59.05 180 top
S1  21.91,63.5 0 top
S2  21.91,55.24 0 top
S3  11.43,55.24 0 top
S4  32.38,55.24 0 top
SD1  55.24,40.32 270 top
SD2  57.78,40.32 270 top
SD3  60.33,40.32 270 top
SD4  62.87,40.32 270 top
SD5  65.41,40.32 270 top
SD6  67.94,40.32 270 top
SERIAL/IR  [1X04']  65.12,51.07 180 top
SERVO1  66.99,82.39 0 top
SERVO2  66.99,84.93 0 top
SG1  63.82,7.3 180 top
SL1  38.73,40.32 270 top
SL2  41.27,40.32 270 top
SL3  43.81,40.32 270 top
SPI  64.65,76.49 270 top
U$1  50.16,23.49 90 top
U$2  13.34,22.86 90 top

### Tracks (layer width: path | path; a pad name or v marks a point on that pad's centre or on a via)
A01
  Bottom 1.27: U$2.A02 14.61,6.82 13.82,6.03 MOTORA.2
A02
  Bottom 1.27: U$2.A01 12.06,7.78 10.32,6.03 MOTORA.1
ARD_RX  (via drill 0.35)  (1 unrouted)
  Top 0.305: BLUETOOTH1.2 U$1.D0/RX | v61.28,57.63 61.28,53.32 62.58,52.02 SERIAL/IR.2
  Bottom 0.305: BLUETOOTH1.2 34.92,10.48 36.2,11.75 38.73,11.75 40.01,10.48 45.09,10.48 46.35,9.21 AUX4.3 | AUX8.3 46.35,56.83 47.78,58.26 52.86,58.26 53.66,57.47 61.12,57.47 v61.28,57.63
ARD_TX  (via drill 0.35)  (1 unrouted)
  Top 0.305: U$1.D1/TX 32.38,14.14 R10.2 | v62.39,57.31 62.39,53.82 65.12,51.09 SERIAL/IR.1
  Bottom 0.305: AUX8.2 47.62,54.93 47.62,56.99 48.26,57.63 52.55,57.63 53.34,56.83 61.91,56.83 v62.39,57.31
B01
  Bottom 1.27: U$2.B01 19.68,7.47 21.12,6.03 MOTORB.2
B02
  Bottom 1.27: U$2.B02 17.14,5.87 MOTORB.1
BT_RX
  Top 0.305: R11.2 R10.1 37.47,11.9 BLUETOOTH1.1
  Bottom 0.254: 45.09,9.22 45.09,6.99
  Bottom 0.305: 45.09,6.99 AUX4.2 | 45.09,9.22 44.46,9.84 37.78,9.84 BLUETOOTH1.1
DIRA  (via drill 0.35)
  Top 0.305: U$2.AIN2 6.99,29.14 8.57,27.55 R9.1 8.76,26.89 8.98,26.66 8.99,26.67 v10.16,26.67
  Bottom 0.305: U$1.D3 35.69,25.26 21.47,25.26 20.22,26.51 10.32,26.51 v10.16,26.67
DIRANEG
  Top 0.305: U$2.AIN1 9.53,28.89 11.11,27.3 11.11,22.76 Q2.3 9.8,21.27 R7.1
DIRB  (via drill 0.35)
  Top 0.305: U$2.BIN1 14.61,26.43 R8.1 15.09,26.68 v15.56,27.15
  Bottom 0.305: U$1.D4 46.03,17.46 44.77,17.46 36.19,26.04 21.59,26.04 20.32,27.3 15.72,27.3 v15.56,27.15
DIRBNEG
  Top 0.305: U$2.BIN2 17.14,29.23 19.37,27 19.37,22.16 Q3.3 19.35,22.14 R6.1
GND  (1 unrouted)
  Top 0.305: R11.1 42.06,13.81 U$1.GND | 22.74,41.27 22.23,41.79
  Top 0.406: 32.07,34.61 34.92,31.75 U$1.GND1 34.92,30.79 34.92,26.04 34.6,25.71 34.6,22.71 35.56,21.76 R5.2 | 5.63,36.95 6.83,35.75 +BAT.1 5.91,35.75 | 9.53,10.61 U$2.GND | 22.23,41.79 U$2.GND3 | 27.94,43.65 7805.GND | 27.62,3.17 AUX3.1 AUX4.1 | 57.12,24.77 55.2,26.69 50.82,26.69 U$1.GND | 33.66,43.65 36.98,40.32 SL1.1 | SL3.1 46.04,38.1 C3.- 51.44,37.78 | U$2.GND2 22.23,11.24 21.59,10.61 | 8.57,9.65 8.13,9.21 C4.- 3.02,9.21 2.22,10.01
  Top 0.508: C2.2 32.16,34.7 32.07,34.61 30.8,34.61 | C1.2 22.45,30.25 U$2.GND3
  Top 1.778: 5.63,36.95 5.63,39.82 7.6,41.79 21.7,41.79 | 29.14,43.65 33.66,43.65 | 2.22,10.01 2.22,32.07 5.91,35.75 | 21.7,41.79 22.23,41.79 | 27.62,3.17 22.54,8.26 22.54,10.61 21.59,10.61 9.53,10.61 8.57,9.65 | 70.48,37.78 SD6.2 SD5.2 SD4.2 SD3.2 SD2.2 SD1.2 51.44,37.78 | 21.7,41.79 23.6,43.7 25.6,43.7 25.65,43.65 27.94,43.65 | SL1.1 SL2.1 SL3.1
  Bottom 0.254: SERIAL/IR.3 61.58,49.53 63.18,49.53 63.84,50.16 63.84,52.7
  Bottom 0.305: BLUETOOTH1.3 34.92,12.7 36.83,12.7 U$1.GND | Q3.1 16.12,20.39 19.05,17.46
  Bottom 0.406: 8.51,35.81 3.96,35.81
  Bottom 0.61: 0.97,32.83 0.97,11.74 2.93,9.79
  Bottom 0.813: 3.96,35.81 0.97,32.83 | U$2.GND2 24.77,17.78 38.42,17.78 40,16.2 U$1.GND | 67.54,43.29 69.96,40.87 69.96,39.3
  Bottom 1.27: 9.53,16.83 10.16,17.46 19.05,17.46 21.27,17.46 22.23,16.51 U$2.GND2 22.23,14.29 31.92,4.59 39.66,4.59 41.07,3.17 AUX3.1 | 6.28,9.79 9.53,13.03 U$2.GND 9.53,16.65 6.35,19.82 | 5.97,38.07 5.97,39.49 8.11,41.63 27.94,41.63 | SL1.1 37.58,40.32 36.27,41.63 27.94,41.63 | 7805.GND 27.94,41.63 | 6.35,27.62 7.12,28.39 20.77,28.39 22.23,29.84 U$2.GND3 | 67.54,43.29 46.67,43.29 43.81,40.44 SL3.1 | 69.96,39.3 68.45,37.78 SD6.2
  pour Bottom (isolate 0.305): 0,0 74.93,0 74.93,45.09 0,45.09
  pour Top (isolate 0.305): 0,0 74.93,0 74.93,45.09 0,45.09
  pour Bottom (isolate 0.305): 0,47.94 74.93,47.94 74.93,93.66 0,93.66
  pour Top (isolate 0.305): 0,47.94 74.93,47.94 74.93,93.66 0,93.66
MCP_A0
  Bottom 0.305: R19.2 13.02,89.22 14.29,90.49 28.21,90.49 38.97,79.72 MCP23017_OUTPUTS.5
MCP_A1
  Bottom 0.305: R21.2 21.27,88.27 22.23,89.22 26.94,89.22 38.95,77.21 39.11,77.21 39.13,77.19 MCP23017_OUTPUTS.7
MCP_A2
  Bottom 0.305: R23.2 23.81,81.41 32.16,81.41 38.93,74.64 MCP23017_OUTPUTS.9
MCP_A3
  Bottom 0.305: R24.2 34.85,76.2 38.94,72.11 MCP23017_OUTPUTS.11
MCP_A4
  Top 0.305: R27.2 32.57,76.33 39.34,69.56 MCP23017_OUTPUTS.13
MCP_A5
  Top 0.305: R26.2 33.84,62.1 38.77,67.03 MCP23017_OUTPUTS.15
MCP_A6
  Bottom 0.305: R13.2 8.12,52.93 S3.3 8.18,54.22 13.02,59.05 22.54,59.05 23.18,59.69 33.66,59.69 38.45,64.48 MCP23017_OUTPUTS.17
MCP_A7
  Bottom 0.305: R12.2 29.08,52.93 | 29.08,52.93 S4.3 | 29.08,52.93 28.94,53.07 37.81,61.95 MCP23017_OUTPUTS.19
MCP_B0
  Bottom 0.305: R16.2 8.57,89.22 10.48,91.12 28.84,91.12 38.97,81 41.35,81 MCP23017_OUTPUTS.6
MCP_B1
  Bottom 0.305: R20.2 17.14,88.9 18.1,89.85 27.56,89.85 38.96,78.45 41.27,78.45 42.55,77.19 MCP23017_OUTPUTS.8
MCP_B2
  Bottom 0.305: R18.2 25.91,87.95 26.91,87.95 38.94,75.92 41.27,75.92 42.55,74.64 MCP23017_OUTPUTS.10
MCP_B3
  Bottom 0.305: R22.2 12.57,82.05 13.97,80.64 31.69,80.64 38.96,73.38 41.35,73.38 MCP23017_OUTPUTS.12
MCP_B4
  Bottom 0.305: R17.2 37.41,72.39 39.03,70.83 41.35,70.83 MCP23017_OUTPUTS.14
MCP_B5
  Top 0.305: R25.2 29.84,62.23 31.11,63.5 34.16,63.5 38.96,68.3 41.52,68.3 42.62,67.2 MCP23017_OUTPUTS.16
MCP_B6
  Bottom 0.305: R15.2 18.62,61.28 | 18.62,61.28 S1.3 | 18.62,61.28 20.84,63.5 36.51,63.5 38.77,65.75 41.35,65.75 MCP23017_OUTPUTS.18
MCP_B7
  Bottom 0.305: R14.2 18.6,52.93 | 18.6,52.93 S2.3 | 18.6,52.93 18.6,54.16 23.5,59.05 33.97,59.05 38.13,63.22 41.35,63.22 MCP23017_OUTPUTS.20
MISO  (via drill 0.35)  (1 unrouted)
  Top 0.305: R1.2 U$1.D12 70.5,13.31 72.39,13.31 B1.1 | SPI.3 64.64,71.41 66.99,69.06 66.99,67.15 v69.69,64.45 | B1B.1 | B1B.1 v68.41,55.42
  Bottom 0.305: U$1.D12 67.94,14.81 65.9,12.77 62.89,12.77 62.07,11.94 57.98,11.94 54.61,8.57 54.61,5.56 52.23,3.17 AUX1.1 | AUX5.1 54.61,54.29 63.5,54.29 66.6,57.39 | 66.6,57.39 69.69,60.48 v69.69,64.45 | v68.41,55.42 66.6,57.23 66.6,57.39
MOSI  (via drill 0.35)  (1 unrouted)
  Top 0.305: v68.74,63.82 66.2,66.36 66.2,67.33 SPI.4
  Bottom 0.305: U$1.D11 63.81,14.28 62.33,14.28 61.56,13.51 57.01,13.51 53.02,9.53 53.02,7.3 AUX1.2 | SERVO1.1 67.63,81.76 67.63,64.93 v68.74,63.82 68.74,60.48 63.23,54.97 54.33,54.97 53.01,53.66 AUX5.2
N$1
  Top 0.305: J1.2 68.9,24.29 70.61,22.57 R3.1
N$3
  Top 0.305: Q1.2 63.34,21.75 R3.2
N$5
  Top 0.508: D1.A 62.53,2.21 SG1.-
  Bottom 0.508: SG1.- 67.73,7.3 70.41,9.98 70.41,17.16 68.04,19.53 Q1.3
N$6
  Top 0.305: R9.2 5.77,26.25 8.53,23.49 Q2.2
N$7
  Top 0.305: 60.01,7.24 SG1.+ | 59.89,6.87 59.83,6.7
  Top 0.508: SG1.+ 60.01,8.41 R2.1 | 59.89,6.87 60.01,7.24 | D1.C 59.83,6.7
N$9
  Top 0.508: Q3.2 17.39,25.45 R8.2
N$10
  Top 0.305: R25.1 29.84,68.26 30.32,68.74 D2.3
N$11  (via drill 0.35)
  Top 0.305: LEDLFE.A v8.57,83.82
  Bottom 0.305: v8.57,83.82 R16.1
N$12  (via drill 0.35)
  Top 0.305: LEDLP.A v14.61,72.39
  Bottom 0.305: v14.61,72.39 R17.1
N$13  (via drill 0.35)
  Top 0.305: LEDLFD.A v25.72,83.82
  Bottom 0.305: v25.72,83.82 R18.1
N$18  (via drill 0.35)
  Top 0.305: LEDDFE.A v13.02,83.82
  Bottom 0.305: v13.02,83.82 R19.1
N$19  (via drill 0.35)
  Top 0.305: LEDDFC.A v17.14,83.82
  Bottom 0.305: v17.14,83.82 R20.1
N$20  (via drill 0.35)
  Top 0.305: LEDDFD.A v21.27,83.82
  Bottom 0.305: v21.27,83.82 R21.1
N$21  (via drill 0.35)
  Top 0.305: LEDDLE.A v11.11,78.11
  Bottom 0.305: v11.11,78.11 R22.1
N$22  (via drill 0.35)
  Top 0.305: LEDDLD.A v23.18,78.11
  Bottom 0.305: v23.18,78.11 R23.1
N$23  (via drill 0.35)
  Top 0.305: LEDDP.A v14.61,76.2
  Bottom 0.305: v14.61,76.2 R24.1
N$30
  Top 0.305: R26.1 33.02,65.72 31.43,67.31 D2.4
N$31
  Top 0.305: R27.1 D2.1
PWMA  (via drill 0.35)
  Top 0.305: v27.62,26.99 20.64,26.99 18.41,29.21 18.41,32.07 17.14,33.34 6.03,33.34 4.45,31.75 U$2.PWMA
  Bottom 0.305: v27.62,26.99 36.5,26.99 45.08,18.41 47.62,18.41 U$1.D5
PWMB  (via drill 0.35)
  Top 0.305: v26.35,27.94 20.95,27.94 19.68,29.21 U$2.PWMB
  Bottom 0.305: v26.35,27.94 36.82,27.94 45.4,19.36 49.21,19.36 U$1.D6
SCK_BUZZ  (via drill 0.35)  (1 unrouted)
  Top 0.305: SPI.5 67.79,63.2 v67.79,63.18
  Bottom 0.305: AUX2.1 50.16,4.45 52.39,4.45 53.82,5.87 53.82,9.05 57.47,12.7 61.75,12.7 62.71,13.65 65.41,13.65 66.67,14.92 66.67,16.83 66.04,17.46 60.01,17.46 58.74,18.73 58.74,26.67 59.85,27.78 63.5,27.78 | 63.5,27.78 64.61,28.89 66.67,28.89 67.94,30.16 U$1.D13 | AUX6.1 50.16,52.39 50.16,54.45 50.64,54.93 53.02,54.93 53.66,55.56 62.87,55.56 67.79,60.48 v67.79,63.18 | 63.5,27.78 J1.1
SCL  (via drill 0.35, 0.35 pad 0.65)  (1 unrouted)
  Top 0.305: v53.02,18.1 53.02,17.78 53.98,16.83 53.98,14.61 v53.02,13.65 | MCP23017_INPUTS.8 56.55,67.03 48.83,59.31 48.99,59.15 | AUX6.3 48.9,59.05 48.99,59.15 | R28.1 49.08,59.05 48.99,59.15 | IMU.2 48.02,87 50.26,84.76 v50.48,84.76
  Bottom 0.305: v53.02,18.1 53.02,26.03 47.94,31.11 U$1.A5 | AUX2.3 48.9,9.21 53.02,13.34 v53.02,13.65 | v50.48,84.76 50.48,73.98 57.44,67.03 MCP23017_INPUTS.8 | DISPLAY.2 48.04,88.03 IMU.2
SD1  (via drill 0.35 pad 0.65)
  Top 0.305: U$1.D2 52.39,25.72 v54.93,25.72
  Bottom 0.305: SD1.3 55.24,33.12 56.52,31.84 56.52,29.37 54.93,27.78 v54.93,25.72
SD2
  Bottom 0.305: U$1.A1 SD2.3
SD3
  Bottom 0.305: U$1.A0 SD3.3
SD4
  Bottom 0.305: SD4.3 61.59,33.97 61.59,30.16 61.12,29.69 58.1,29.69 55.88,27.46 55.88,25.4 55.24,24.76 U$1.D7
SD5
  Bottom 0.305: SD5.3 64.14,33.97 64.14,30.38 62.81,29.05 58.74,29.05 56.83,27.14 56.83,16.82 U$1.D8
SD6
  Bottom 0.305: SD6.3 66.67,33.97 66.67,30.16 66.04,29.53 64.24,29.53 63.11,28.42 59.32,28.42 57.78,26.88 57.78,18.41 U$1.D9
SDA  (via drill 0.35)  (1 unrouted)
  Top 0.254: 47.62,58.9 47.62,55.39
  Top 0.305: AUX6.2 48.9,54.12 47.62,55.39 | MCP23017_INPUTS.7 47.76,59.57 47.76,59.37 R29.1 47.47,59.05 47.62,58.9 | IMU.1 45.8,88.03 50.64,83.19 v51.75,83.19
  Bottom 0.254: 50.16,9.21 50.16,7.13
  Bottom 0.305: U$1.A4 53.98,27.3 53.98,13.02 50.16,9.21 | AUX2.2 48.9,5.86 50.16,7.13 | MCP23017_INPUTS.7 55.85,69.56 51.22,74.2 51.22,83.19 | DISPLAY.1 51.83,89.28 51.83,83.98 51.22,83.36 51.22,83.19 | v51.75,83.19 51.22,83.19
SL1
  Bottom 0.305: SL1.3 39.05,35.24 40.64,33.65 42.22,33.65 44.77,31.11 U$1.A6
SL2
  Bottom 0.305: U$1.A3 52.38,31.11 50.79,32.7 44.13,32.7 41.59,35.24 SL2.3
SL3
  Bottom 0.305: SL3.3 45.72,33.34 52.7,33.34 54.92,31.11 U$1.A2
SS  (1 unrouted)
  Bottom 0.305: AUX1.3 51.44,9.21 56.52,14.29 61.28,14.29 U$1.D10 | AUX5.3 62.55,56.2 66.86,60.51 66.86,63.78 | SERVO2.1 65.56,83.5 65.56,81.6 66.86,80.3 66.86,63.78 | 66.86,63.78 66.56,63.79 SPI.6
VBAT
  Bottom 1.27: 18.93,38.53 18.73,38.73 18.93,38.94 | 14.03,38.73 13.94,38.64 13.84,38.54
  Bottom 1.778: 14.03,38.73 18.73,38.73 | GENERAL_SWITCH.C2 18.93,38.53 | GENERAL_SWITCH.D2 18.93,38.94 | GENERAL_SWITCH.D1 13.94,38.64 GENERAL_SWITCH.C1 | +BAT.2 13.84,38.54
VBAT1
  Bottom 1.778: 5.08,62.13 GENERAL_SWITCH1.D1 GENERAL_SWITCH1.C1 | GENERAL_SWITCH1.C2 GENERAL_SWITCH1.D2 5.08,62.13 | 5.08,62.13 5.08,60.45 +BAT1.2
VCCARD  (via drill 0.35)  (1 unrouted)
  Top 0.305: R2.2 54.46,11.67 56.06,13.27 66.13,13.27 72.39,7.01 B1.2 | S3.1 11.97,57.51 13.53,59.07 15.83,59.07 17.39,57.51 S2.1 22.45,57.51 24.01,59.07 24.71,59.07 | 24.71,59.07 18.66,65.13 S1.1 | R29.2 43.81,58.23 AUX7.3 40.95,59.07 34.49,59.07 32.92,57.51 S4.1 27.87,57.51 26.31,59.07 24.71,59.07 | R28.2 57.18,59.05 57.5,59.05 | v63.5,60.33 B1B.2 | B1B.2
  Top 0.508: R2.2 46.67,11.11 AUX3.3 | SERIAL/IR.4 57.5,59.05 | 57.18,59.05 57.18,61.38 MCP23017_INPUTS.10
  Top 0.813: U$1.+5V 40,20.32 38.44,18.75 31.01,18.75 29.84,17.59 BLUETOOTH1.4 | DISPLAY.3 49.7,92.23 53.82,92.23 54.77,91.28 54.77,89.69 IMU.4
  Bottom 0.305: MCP23017_INPUTS.10 61.88,61.95 v63.5,60.33
  Bottom 0.813: BLUETOOTH1.4 31.75,8.26 AUX3.3 | AUX7.3 47.02,59.41 55.85,59.41 57.75,61.31 MCP23017_INPUTS.10 59.09,61.95 60.96,63.82 60.96,73.98 | 60.96,73.98 60.96,86.36 59.29,88.03 IMU.4 | SPI.2 64.63,73.98 60.96,73.98
VCCSENS  (1 unrouted)
  Top 0.305: 12.06,20.32 9.84,18.1 U$2.VCC | R6.2 21.69,17.88 23.18,17.78
  Top 0.508: R7.2 9.66,18.28 9.84,18.1 | C2.1 30.71,37.7 7805.OUT
  Top 0.813: U$2.STBY 12.06,20.32 12.06,18.73 13.02,17.78 23.18,17.78 25.08,17.78 27.08,15.79 27.08,8.59 29.95,5.71 AUX3.2 | AUX7.2 42.07,51.91 42.07,50.01 43.81,48.26 66.04,48.26 73.82,56.04 73.82,77.47 69.53,81.76 SERVO1.2
  Bottom 0.813: U$2.STBY 12.06,31.75 | SERVO2.2 SERVO1.2
  Bottom 1.27: 12.06,31.75 13.97,33.66 27.62,33.66 30.48,36.51 7805.OUT
  Bottom 1.778: SD6.1 SD5.1 SD4.1 SD3.1 SD2.1 SD1.1 51.59,40.32 50.64,41.27 49.53,41.27 | 49.53,41.27 48.26,41.27 44.77,37.78 SL3.2 SL2.2 SL1.2 30.8,37.78 7805.OUT | 49.53,41.27 C3.+
VINMOT
  Bottom 1.778: GENERAL_SWITCH.B1 12.66,35.66 10.53,33.53 4.17,33.53 2.53,31.89 2.53,29.07 4.45,27.15 U$2.VM C4.+
VINVREG  (1 unrouted)
  Top 0.305: C1.1 27,34.85 27.07,34.85
  Top 0.406: U$1.VIN 32.38,29.22 R4.1
  Top 0.508: U$1.VIN
  Top 0.813: 7805.IN 25.4,36.51 27.07,34.85 30.8,31.11 U$1.VIN
  Bottom 1.778: 7805.IN 24.45,37.47 22.65,35.66 GENERAL_SWITCH.B2 | GENERAL_SWITCH1.B1 5.4,66.14 | 5.4,66.14 GENERAL_SWITCH1.B2 | 5.4,66.14 5.4,67.5 +BAT2.2
VREFBAT
  Top 0.305: 38.76,31.94 38.76,30.18
  Top 0.406: 38.76,31.94 39.49,32.67 40.98,32.67 U$1.A7 | 38.76,30.18 36.67,28.1 R4.2 36.35,26.19 36.2,26.03 R5.1

### Text on the board
Top: 2018 | EDU ms-shield | 2018 | EDU mini-sumo v2 complete board - rev c | 2018 | 2018 | EDU mini-sumo v2
Bottom: Vicent Colomar | Vicent Colomar
_tsilk: DISPLAY | F | IMU | SERVO2 | D | D | L | L | E | SERVO1 | D | D | D | OUT | R27 | D | L | SPI | P | MCP23017 | On/Off | B2 | CC BY-NC-SA | R25 | R26 | R29 | B1 | BAT | R28 | B4 | B3 | B5 | AUX | EDU ms-shield | S.LINIA | S.DISTANCIA | On/Off | 1 | 2 | 3 | 1 | 2 | 3 | 4 | 5 | 6 | 5VREG | C2 | C3 | BAT+ | C1 | TB6612FNQ | J1 | R9 | R8 | R4 | USB | Q2 | R6 | R5 | CC BY-NC-SA | Q1 | R3 | Q3 | R7 | R1 | ARDUINO NANO | R10 | R11 | R2 | B1 | BUZ | SERIAL | C4 | MD | IR | ME | AUX | D1 | EDU mini-sumo v2
_bsilk: C | D | D | C | R16 | R19 | R20 | R21 | R18 | LLFE/0 | R22 | R23 | 8/LDFE | LDFC/1 | R24 | 9/LDFD | LLFD/2 | 10/LDD | R17 | LDE/3 | R | 11/LDP | LLP/4 | 12/R | D | G | G/5 | B | 13/B | C | B2/6 | 14/B4 | R15 | B3/7 | 15/B5 | CC BY-NC-SA | R13 | R14 | R12 | CC BY-NC-SA | BAT | SL1 | SCL | SDA | SL2 | SL3 | SD2 | SD3 | SCK/BUZ | PWMA | DIRA | DIRA- | DIRB | DIRB- | PWMB | TX | RX | SD1 | DIRA | DIRB | PWMA | PWMB | SD4 | SD5 | SD6 | B1/MISO | SS | MOSI | VCCA | RX | SCL | SS | VCCS | TX | SDA | MOSI | GND | GND | SCK | MISO